# EasyEDA schematic Dino.json
TITLE: Dino; REV: 1.0; Date: 2021-08-27; Sheet: 1/1; Company: Your Company
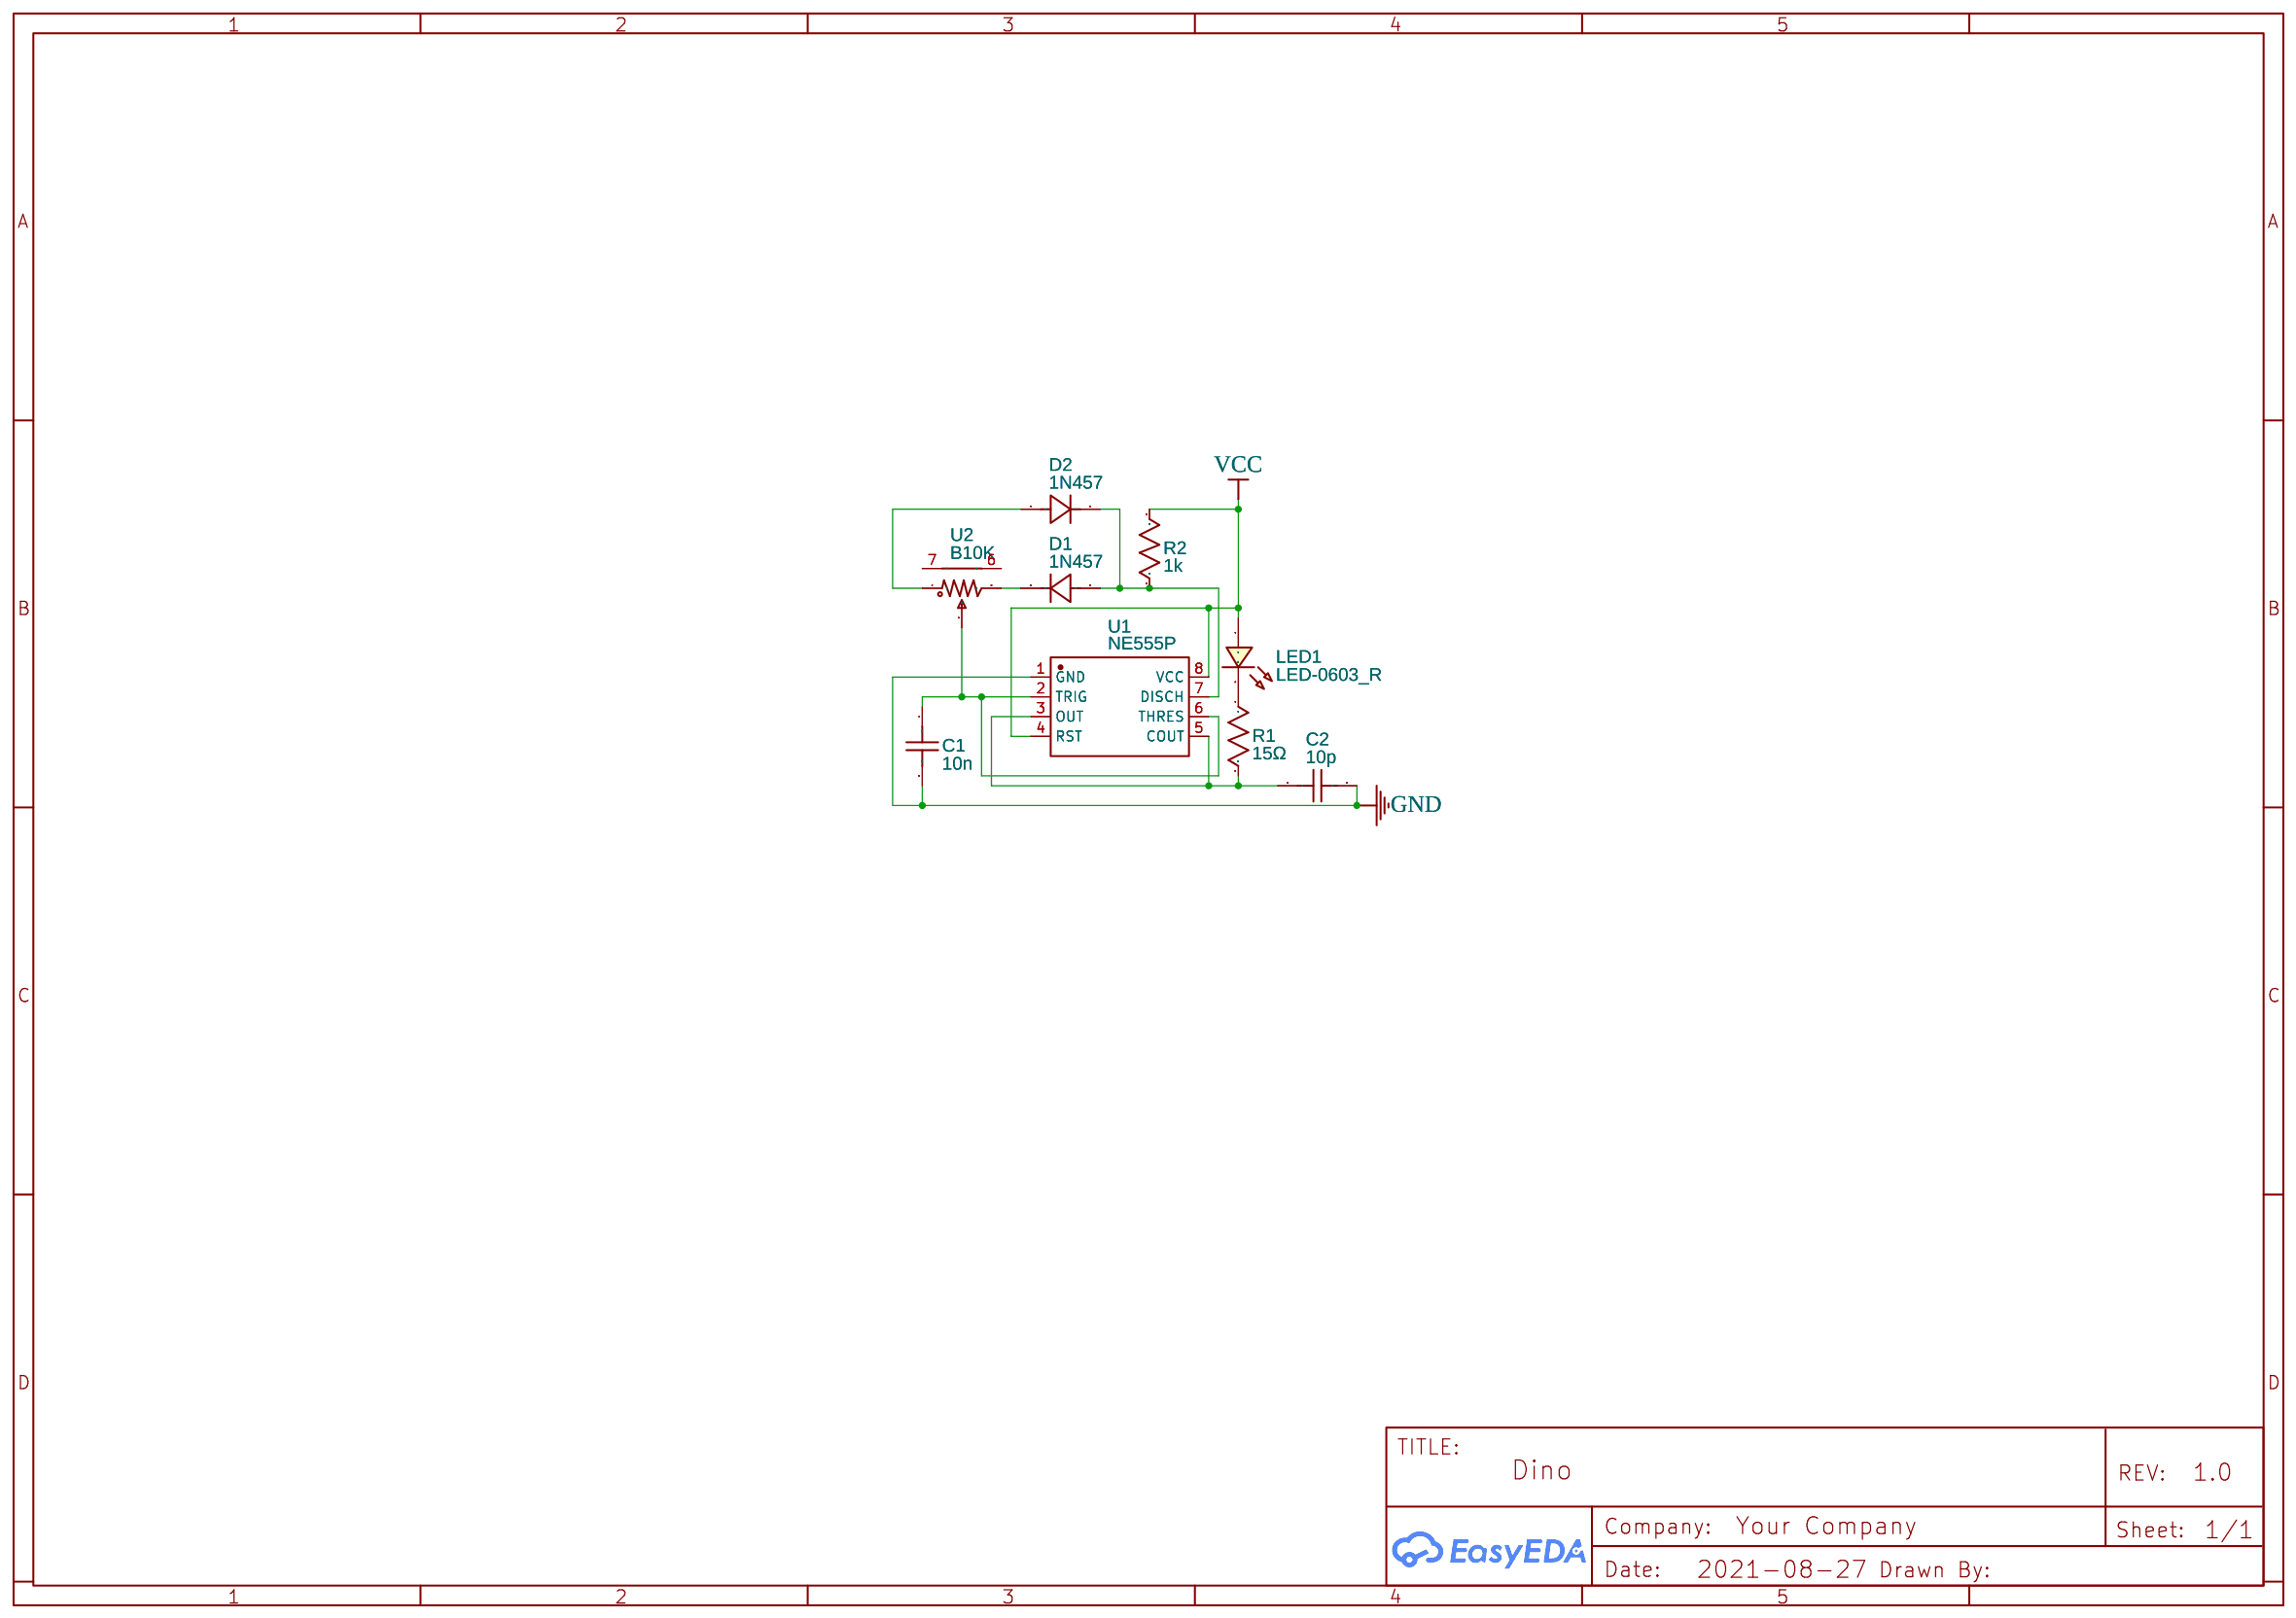
[diagram p0: schematic sheet]

## Parts
C1  10n  [C0603]
C2  10p  [C0603]
D1  1N457  [DO-35_BD1.7-L3.8-P7.8-D0.5-FD]
D2  1N457  [DO-35_BD1.7-L3.8-P7.8-D0.5-FD]
LED1  LED-0603_R  [LED0603_RED]
R1  15Ω  [R0603]
R2  1k  [R0603]
U1  NE555P  [DIP-8_L9.8-W6.6-P2.54-LS7.6-BL]
U2  B10K  [RES-ADJ-TH_BK10]

## Library data of the parts
C1 C2 = C_0603_US: Contributor: LCEDA_Lib
D1 D2 = 1N457: Supplier: LCSC; Supplier Part: C895219; Manufacturer: ON(安森美); JLCPCB Part Class: Extended Part; Contributor: LCSC
LED1 = LED-0603_R: Manufacturer: EVERLIGHT(台湾亿光); Manufacturer Part: 19-217/R6C-AL1M2VY/3T; Supplier Part: C72044; Supplier: LCSC; Contributor: LCEDA_01
R1 R2 = R_0603_US: Contributor: LCEDA_Lib
U1 = NE555P: Supplier: LCSC; Manufacturer: TI; Supplier Part: C46749; JLCPCB Part Class: Extended Part
U2 = B10K: Supplier: LCSC; Supplier Part: C2839839; Manufacturer: null; JLCPCB Part Class: Extended Part; Contributor: LCSC

## Nets
GND: C1.2 C2.2 U1.1(GND)
VCC: LED1.1 R2.2 U1.4(RST) U1.8(VCC)
Net-(C1-1): C1.1 U1.2(TRIG) U1.6(THRES) U2.2
Net-(C2-1): C2.1 R1.2 U1.3(OUT) U1.5(COUT)
Net-(D1-1): D1.1(K) D2.2(A) R2.1 U1.7(DISCH)
Net-(D1-2): D1.2(A) U2.3
Net-(D2-1): D2.1(K) U2.1
Net-(LED1-2): LED1.2 R1.1

Not connected (* = marked no-connect by the designer): U2 6 7
